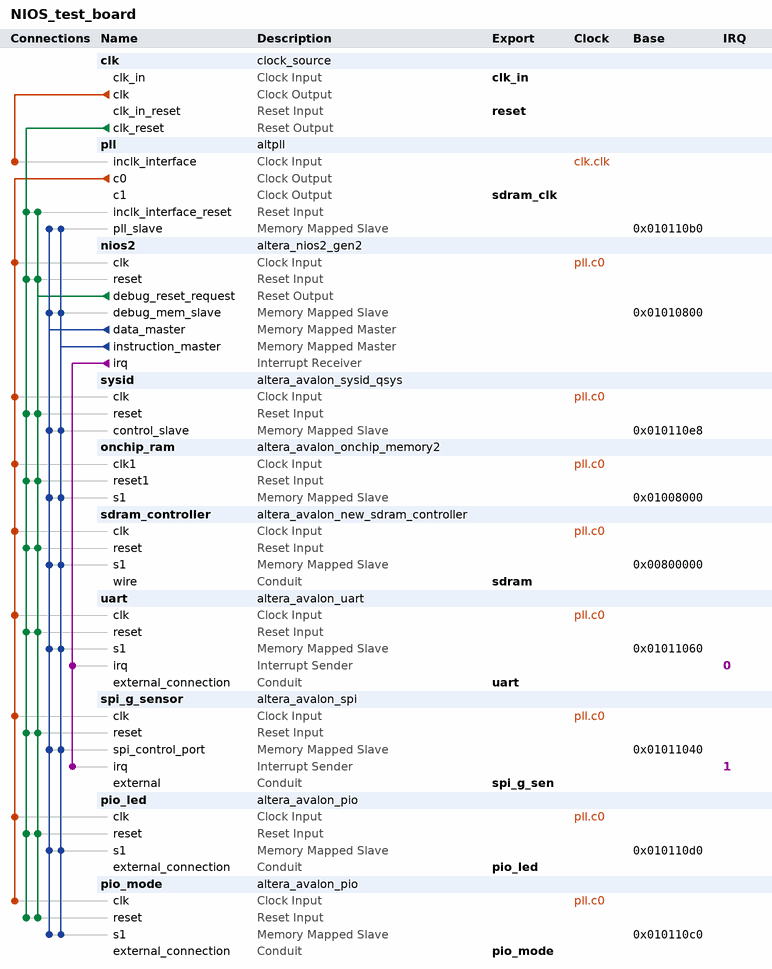
[diagram p0: system contents]
# Platform Designer (Qsys) system NIOS_test_board, Cyclone 10 LP 10CL025YU256C8G
# Parameters at their usual value, and those the tool derives, are not listed.
package require -exact qsys 18.1
create_system NIOS_test_board
set_project_property DEVICE_FAMILY {Cyclone 10 LP}
set_project_property DEVICE 10CL025YU256C8G

add_instance clk clock_source 18.1
set_instance_parameter_value clk clockFrequency 50000000

add_instance pll altpll 18.1
set_instance_parameter_value pll CLK0_DIVIDE_BY 6
set_instance_parameter_value pll CLK0_MULTIPLY_BY 25
set_instance_parameter_value pll CLK1_DIVIDE_BY 6
set_instance_parameter_value pll CLK1_DUTY_CYCLE 50
set_instance_parameter_value pll CLK1_MULTIPLY_BY 25
set_instance_parameter_value pll CLK1_PHASE_SHIFT -5000
set_instance_parameter_value pll INCLK0_INPUT_FREQUENCY 83333
set_instance_parameter_value pll PORT_ARESET PORT_UNUSED
set_instance_parameter_value pll PORT_LOCKED PORT_UNUSED
set_instance_parameter_value pll PORT_clk1 PORT_USED
set_instance_parameter_value pll PORT_clk2 PORT_UNUSED
set_instance_parameter_value pll PORT_clk3 PORT_UNUSED

add_instance nios2 altera_nios2_gen2 18.1
set_instance_parameter_value nios2 dcache_size 2048
set_instance_parameter_value nios2 exceptionSlave onchip_ram.s1
set_instance_parameter_value nios2 icache_size 4096
set_instance_parameter_value nios2 impl Tiny
set_instance_parameter_value nios2 resetSlave onchip_ram.s1

add_instance sysid altera_avalon_sysid_qsys 18.1
set_instance_parameter_value sysid id 403892959

add_instance onchip_ram altera_avalon_onchip_memory2 18.1
set_instance_parameter_value onchip_ram dataWidth 32
set_instance_parameter_value onchip_ram dualPort false
set_instance_parameter_value onchip_ram initMemContent true
set_instance_parameter_value onchip_ram initializationFileName S:/Projekte/TEI0003/18.1/test_board/software/test_board/mem_init/NIOS_test_board_onchip_ram.hex
set_instance_parameter_value onchip_ram memorySize 32768
set_instance_parameter_value onchip_ram useNonDefaultInitFile true

add_instance sdram_controller altera_avalon_new_sdram_controller 18.1
set_instance_parameter_value sdram_controller TAC 6.0
set_instance_parameter_value sdram_controller TRCD 15.0
set_instance_parameter_value sdram_controller TRFC 72.0
set_instance_parameter_value sdram_controller TRP 15.0
set_instance_parameter_value sdram_controller casLatency 2
set_instance_parameter_value sdram_controller columnWidth 8
set_instance_parameter_value sdram_controller dataWidth 16
set_instance_parameter_value sdram_controller generateSimulationModel false
set_instance_parameter_value sdram_controller model single_Micron_MT48LC4M32B2_7_chip
set_instance_parameter_value sdram_controller numberOfBanks 4
set_instance_parameter_value sdram_controller numberOfChipSelects 1
set_instance_parameter_value sdram_controller powerUpDelay 200.0
set_instance_parameter_value sdram_controller refreshPeriod 15.625
set_instance_parameter_value sdram_controller rowWidth 12

add_instance uart altera_avalon_uart 18.1
set_instance_parameter_value uart baud 115200
set_instance_parameter_value uart dataBits 8
set_instance_parameter_value uart fixedBaud true
set_instance_parameter_value uart parity NONE
set_instance_parameter_value uart stopBits 1

add_instance spi_g_sensor altera_avalon_spi 18.1
set_instance_parameter_value spi_g_sensor clockPolarity 0
set_instance_parameter_value spi_g_sensor dataWidth 8
set_instance_parameter_value spi_g_sensor masterSPI true
set_instance_parameter_value spi_g_sensor numberOfSlaves 1
set_instance_parameter_value spi_g_sensor targetClockRate 128000

add_instance pio_led altera_avalon_pio 18.1
set_instance_parameter_value pio_led direction Output
set_instance_parameter_value pio_led width 8

add_instance pio_mode altera_avalon_pio 18.1
set_instance_parameter_value pio_mode direction Input
set_instance_parameter_value pio_mode width 3

# connections
add_connection clk.clk pll.inclk_interface clock
add_connection pll.c0 nios2.clk clock
add_connection pll.c0 onchip_ram.clk1 clock
add_connection pll.c0 pio_led.clk clock
add_connection pll.c0 pio_mode.clk clock
add_connection pll.c0 sdram_controller.clk clock
add_connection pll.c0 spi_g_sensor.clk clock
add_connection pll.c0 sysid.clk clock
add_connection pll.c0 uart.clk clock
add_connection clk.clk_reset nios2.reset reset
add_connection clk.clk_reset onchip_ram.reset1 reset
add_connection clk.clk_reset pio_led.reset reset
add_connection clk.clk_reset pio_mode.reset reset
add_connection clk.clk_reset pll.inclk_interface_reset reset
add_connection clk.clk_reset sdram_controller.reset reset
add_connection clk.clk_reset spi_g_sensor.reset reset
add_connection clk.clk_reset sysid.reset reset
add_connection clk.clk_reset uart.reset reset
add_connection nios2.debug_reset_request nios2.reset reset
add_connection nios2.debug_reset_request onchip_ram.reset1 reset
add_connection nios2.debug_reset_request pio_led.reset reset
add_connection nios2.debug_reset_request pio_mode.reset reset
add_connection nios2.debug_reset_request pll.inclk_interface_reset reset
add_connection nios2.debug_reset_request sdram_controller.reset reset
add_connection nios2.debug_reset_request spi_g_sensor.reset reset
add_connection nios2.debug_reset_request sysid.reset reset
add_connection nios2.debug_reset_request uart.reset reset
add_connection nios2.data_master nios2.debug_mem_slave avalon
set_connection_parameter_value nios2.data_master/nios2.debug_mem_slave baseAddress 0x01010800
add_connection nios2.data_master onchip_ram.s1 avalon
set_connection_parameter_value nios2.data_master/onchip_ram.s1 baseAddress 0x01008000
add_connection nios2.data_master pio_led.s1 avalon
set_connection_parameter_value nios2.data_master/pio_led.s1 baseAddress 0x010110d0
add_connection nios2.data_master pio_mode.s1 avalon
set_connection_parameter_value nios2.data_master/pio_mode.s1 baseAddress 0x010110c0
add_connection nios2.data_master pll.pll_slave avalon
set_connection_parameter_value nios2.data_master/pll.pll_slave baseAddress 0x010110b0
add_connection nios2.data_master sdram_controller.s1 avalon
set_connection_parameter_value nios2.data_master/sdram_controller.s1 baseAddress 0x00800000
add_connection nios2.data_master spi_g_sensor.spi_control_port avalon
set_connection_parameter_value nios2.data_master/spi_g_sensor.spi_control_port baseAddress 0x01011040
add_connection nios2.data_master sysid.control_slave avalon
set_connection_parameter_value nios2.data_master/sysid.control_slave baseAddress 0x010110e8
add_connection nios2.data_master uart.s1 avalon
set_connection_parameter_value nios2.data_master/uart.s1 baseAddress 0x01011060
add_connection nios2.instruction_master nios2.debug_mem_slave avalon
set_connection_parameter_value nios2.instruction_master/nios2.debug_mem_slave baseAddress 0x01010800
add_connection nios2.instruction_master onchip_ram.s1 avalon
set_connection_parameter_value nios2.instruction_master/onchip_ram.s1 baseAddress 0x01008000
add_connection nios2.instruction_master pio_led.s1 avalon
set_connection_parameter_value nios2.instruction_master/pio_led.s1 baseAddress 0x010110d0
add_connection nios2.instruction_master pio_mode.s1 avalon
set_connection_parameter_value nios2.instruction_master/pio_mode.s1 baseAddress 0x010110c0
add_connection nios2.instruction_master pll.pll_slave avalon
set_connection_parameter_value nios2.instruction_master/pll.pll_slave baseAddress 0x010110b0
add_connection nios2.instruction_master sdram_controller.s1 avalon
set_connection_parameter_value nios2.instruction_master/sdram_controller.s1 baseAddress 0x00800000
add_connection nios2.instruction_master spi_g_sensor.spi_control_port avalon
set_connection_parameter_value nios2.instruction_master/spi_g_sensor.spi_control_port baseAddress 0x01011040
add_connection nios2.instruction_master sysid.control_slave avalon
set_connection_parameter_value nios2.instruction_master/sysid.control_slave baseAddress 0x010110e8
add_connection nios2.instruction_master uart.s1 avalon
set_connection_parameter_value nios2.instruction_master/uart.s1 baseAddress 0x01011060
add_connection nios2.irq spi_g_sensor.irq interrupt
set_connection_parameter_value nios2.irq/spi_g_sensor.irq irqNumber 1
add_connection nios2.irq uart.irq interrupt
set_connection_parameter_value nios2.irq/uart.irq irqNumber 0

# exported interfaces
add_interface clk_in clock sink
set_interface_property clk_in EXPORT_OF clk.clk_in
add_interface pio_led conduit end
set_interface_property pio_led EXPORT_OF pio_led.external_connection
add_interface pio_mode conduit end
set_interface_property pio_mode EXPORT_OF pio_mode.external_connection
add_interface reset reset sink
set_interface_property reset EXPORT_OF clk.clk_in_reset
add_interface sdram conduit end
set_interface_property sdram EXPORT_OF sdram_controller.wire
add_interface sdram_clk clock source
set_interface_property sdram_clk EXPORT_OF pll.c1
add_interface spi_g_sen conduit end
set_interface_property spi_g_sen EXPORT_OF spi_g_sensor.external
add_interface uart conduit end
set_interface_property uart EXPORT_OF uart.external_connection

set_interconnect_requirement {$system} qsys_mm.clockCrossingAdapter HANDSHAKE
set_interconnect_requirement {$system} qsys_mm.enableEccProtection FALSE
set_interconnect_requirement {$system} qsys_mm.insertDefaultSlave FALSE
set_interconnect_requirement {$system} qsys_mm.maxAdditionalLatency 1

save_system NIOS_test_board.qsys
